# Altium schematic sheet Smart-Watch-Front.SchDoc
size A4; SheetNumber: 1; SheetTotal: 7
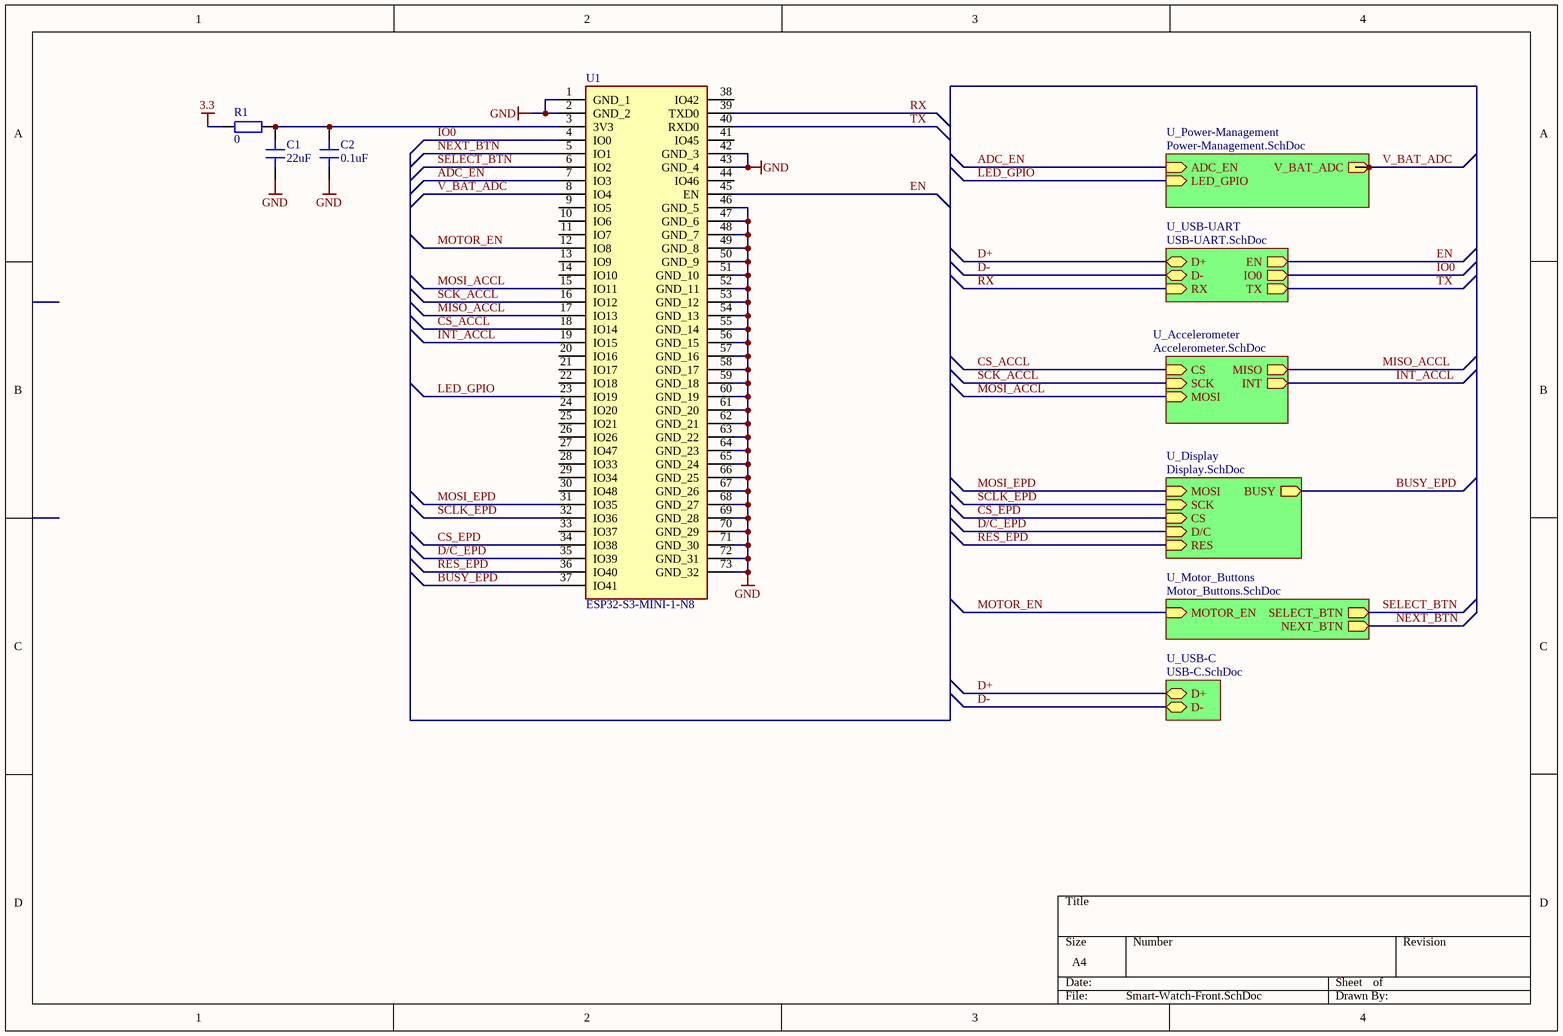
[diagram p0: Smart-Watch-Front.SchDoc]

## Parts
C1  22uF  [0603_CAP]
C2  0.1uF  [0603_CAP]
R1  0  [0603]
U1  ESP32-S3-MINI-1-N8  [ESP32S3MINI1N8]

## Sub-sheets
U_Accelerometer = Accelerometer.SchDoc: CS (in), SCK (in), MISO (out), MOSI (in), INT (out)
U_Display = Display.SchDoc: MOSI (in), SCK (in), CS (in), D/C (in), RES (in), BUSY (out)
U_Motor_Buttons = Motor_Buttons.SchDoc: MOTOR_EN (in), SELECT_BTN (out), NEXT_BTN (out)
U_Power-Management = Power-Management.SchDoc: V_BAT_ADC (out), ADC_EN (in), LED_GPIO (in)
U_USB-C = USB-C.SchDoc: D+ (bidir), D- (bidir)
U_USB-UART = USB-UART.SchDoc: D+ (bidir), D- (bidir), RX (in), EN (out), IO0 (out), TX (out)

## Nets
3.3: R1.1
GND: C1.1 C2.1 U1.1(GND_1) U1.2(GND_2) U1.42(GND_3) U1.43(GND_4) U1.46(GND_5) U1.47(GND_6) U1.48(GND_7) U1.49(GND_8) U1.50(GND_9) U1.51(GND_10) U1.52(GND_11) U1.53(GND_12) U1.54(GND_13) U1.55(GND_14) U1.56(GND_15) U1.57(GND_16) U1.58(GND_17) U1.59(GND_18) U1.60(GND_19) U1.61(GND_20) U1.62(GND_21) U1.63(GND_22) U1.64(GND_23) U1.65(GND_24) U1.66(GND_25) U1.67(GND_26) U1.68(GND_27) U1.69(GND_28) U1.70(GND_29) U1.71(GND_30) U1.72(GND_31) U1.73(GND_32)
ADC_EN: U1.7(IO3) ; sheet U_Power-Management/ADC_EN
BUSY_EPD: U1.37(IO41) ; sheet U_Display/BUSY
CS_ACCL: U1.18(IO14) ; sheet U_Accelerometer/CS
CS_EPD: U1.34(IO38) ; sheet U_Display/CS
D+: sheet U_USB-UART/D+, sheet U_USB-C/D+
D-: sheet U_USB-UART/D-, sheet U_USB-C/D-
D/C_EPD: U1.35(IO39) ; sheet U_Display/D/C
EN: U1.45(EN) ; sheet U_USB-UART/EN
INT_ACCL: U1.19(IO15) ; sheet U_Accelerometer/INT
IO0: U1.4(IO0) ; sheet U_USB-UART/IO0
LED_GPIO: U1.23(IO19) ; sheet U_Power-Management/LED_GPIO
MISO_ACCL: U1.17(IO13) ; sheet U_Accelerometer/MISO
MOSI_ACCL: U1.15(IO11) ; sheet U_Accelerometer/MOSI
MOSI_EPD: U1.31(IO35) ; sheet U_Display/MOSI
MOTOR_EN: U1.12(IO8) ; sheet U_Motor_Buttons/MOTOR_EN
NEXT_BTN: U1.5(IO1) ; sheet U_Motor_Buttons/NEXT_BTN
RES_EPD: U1.36(IO40) ; sheet U_Display/RES
RX: U1.39(TXD0) ; sheet U_USB-UART/RX
SCK_ACCL: U1.16(IO12) ; sheet U_Accelerometer/SCK
SCLK_EPD: U1.32(IO36) ; sheet U_Display/SCK
SELECT_BTN: U1.6(IO2) ; sheet U_Motor_Buttons/SELECT_BTN
TX: U1.40(RXD0) ; sheet U_USB-UART/TX
V_BAT_ADC: U1.8(IO4) ; sheet U_Power-Management/V_BAT_ADC
NetC1_2: C1.2 C2.2 R1.2 U1.3(3V3)

Not connected (* = marked no-connect by the designer): U1 9(IO5) 10(IO6) 11(IO7) 13(IO9) 14(IO10) 20(IO16) 21(IO17) 22(IO18) 24(IO20) 25(IO21) 26(IO26) 27(IO47) 28(IO33) 29(IO34) 30(IO48) 33(IO37) 38(IO42) 41(IO45) 44(IO46)

## Library data of the parts
C1 C2 = C
R1 = R
U1 = ESP32-S3-MINI-1-N8: Integrated Circuit; Manufacturer_Name: Espressif Systems; Datasheet Link: https://www.espressif.com/sites/default/files/documentation/esp32-s3-mini-1_mini-1u_datasheet_en.pdf; Height: 2.55mm; Manufacturer_Part_Number: ESP32-S3-MINI-1-N8; Mouser Part Number: 356-ESP32-S3-MINI1N8; Mouser Price/Stock: https://www.mouser.co.uk/ProductDetail/Espressif-Systems/ESP32-S3-MINI-1-N8?qs=XAiT9M5g4x82rl6F%2FIYUQg%3D%3D